# Altium schematic sheet CAN.SchDoc
size A4; SheetNumber: 3; SheetTotal: 3
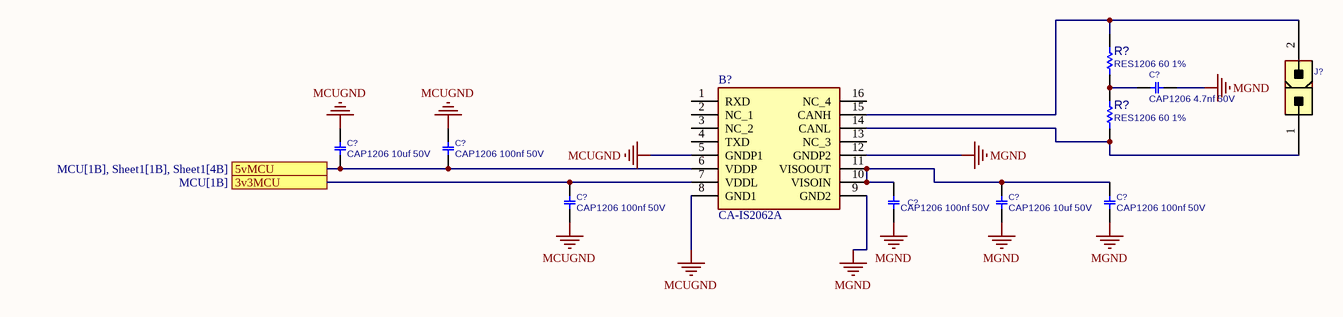
[diagram p0: CAN.SchDoc]

## Parts
(Parts that share a designator on the sheet are numbered #1, #2 ... from top to bottom, then left to right.)
B?  CA-IS2062A  [CAIS2062A]
C?#1  CAP1206 4.7nf 50V  [C1206]
C?#2  CAP1206 10uf 50V  [C1206]
C?#3  CAP1206 100nf 50V  [C1206]
C?#4  CAP1206 100nf 50V  [C1206]
C?#5  CAP1206 100nf 50V  [C1206]
C?#6  CAP1206 10uf 50V  [C1206]
C?#7  CAP1206 100nf 50V  [C1206]
J?  CONN_ATXPWR_2  [ATXPWR_2]  (value not drawn)
R?#1  RES1206 60 1%  [R1206]
R?#2  RES1206 60 1%  [R1206]

## Ports
3v3MCU (see MCU[1B]), 5vMCU (see MCU[1B], Sheet1[1B], Sheet1[4B])

## Nets
MCUGND: B?.5(GNDP1) B?.8(GND1) C?#2.1 C?#3.1 C?#4.2
MGND: B?.9(GND2) B?.12(GNDP2) C?#1.2 C?#5.2 C?#6.2 C?#7.2
3v3MCU: B?.7(VDDL) C?#4.1 ; port 3v3MCU
5vMCU: B?.6(VDDP) C?#2.2 C?#3.2 ; port 5vMCU
NetB?_10: B?.10(VISOIN) B?.11(VISOOUT) C?#5.1 C?#6.1 C?#7.1
NetB?_14: B?.14(CANL) J?.1 R?#2.1
NetB?_15: B?.15(CANH) J?.2 R?#1.2
NetC?#1_1: C?#1.1 R?#1.1 R?#2.2

Not connected (* = marked no-connect by the designer): B? 1(RXD) 2(NC_1) 3(NC_2) 4(TXD) 13(NC_3) 16(NC_4)

## Library data of the parts
B? = CA-IS2062A: LGA-16(4.7x5.2) Isolated CAN Transceivers (with Power) ROHS; Manufacturer_Name: ChipAnalog; Geometry.Height: 1.09mm; Manufacturer_Part_Number: CA-IS2062A; Mouser Part Number: *; Mouser Price/Stock: *; Arrow Part Number: *; Arrow Price/Stock: *; Datasheet Link: https://e.chipanalog.com/Public/Uploads/uploadfile/files/20250325/CAIS2062AdatasheetVersion1.01en20250325.pdf
C?#1-C?#7 = CAP_SMD_MLCC_1206: CAP, MLCC; PARAM: -, -%; MANF_P#: MANF_PART#; PARAM2: -V; PRICE: 100= 1$; MANF: -; ASSEMBLY: ASSEMBLY
J? = CONN_ATXPWR_2: CONN, ATX POWER, 2 P; MANF: Molex; MANF_P#: 39281023; VALUE: CONN_ATXPWR_2; MountType: THD; PACKAGE: ATXPWR-2pin; Part Type: Conn.
R?#1 R?#2 = RES_SMD_1206: RESISTOR, SMD; PARAM: 1%, 0.25W; DESC: DESCRIPTION; DIST#: MOUSER; MANF_P#: -; MANF: -; ASSEMBLY: ASSEMBLY; PRICE: -; PARAM2: -